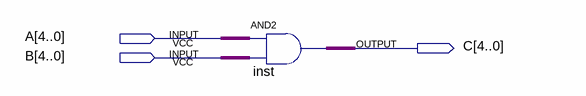
[diagram p0: schematic sheet]
// Quartus schematic AND.bdf as structural Verilog: 1 symbols, 3 pins
module AND (
  input  [4:0] A,
  input  [4:0] B,
  output [4:0] C
);

  assign C = A & B;  // AND2 inst, 5 bits wide
endmodule
